# Altium schematic sheet PD_MK2_Main.SchDoc: Sample Sheet Title
size B; Date: MM/DD/YYYY; Author: Sample Author; Organization: ORGANIZATION; Address1: ADDRESS 1; Address2: ADDRESS 2; Address3: ADDRESS 3; Address4: ADDRESS 4; Revision: -; SheetNumber: 2; SheetTotal: 2; ENG_APP_DATE: --/--/--; DSN_APP_DATE: --/--/--; CHK_APP_DATE: --/--/--
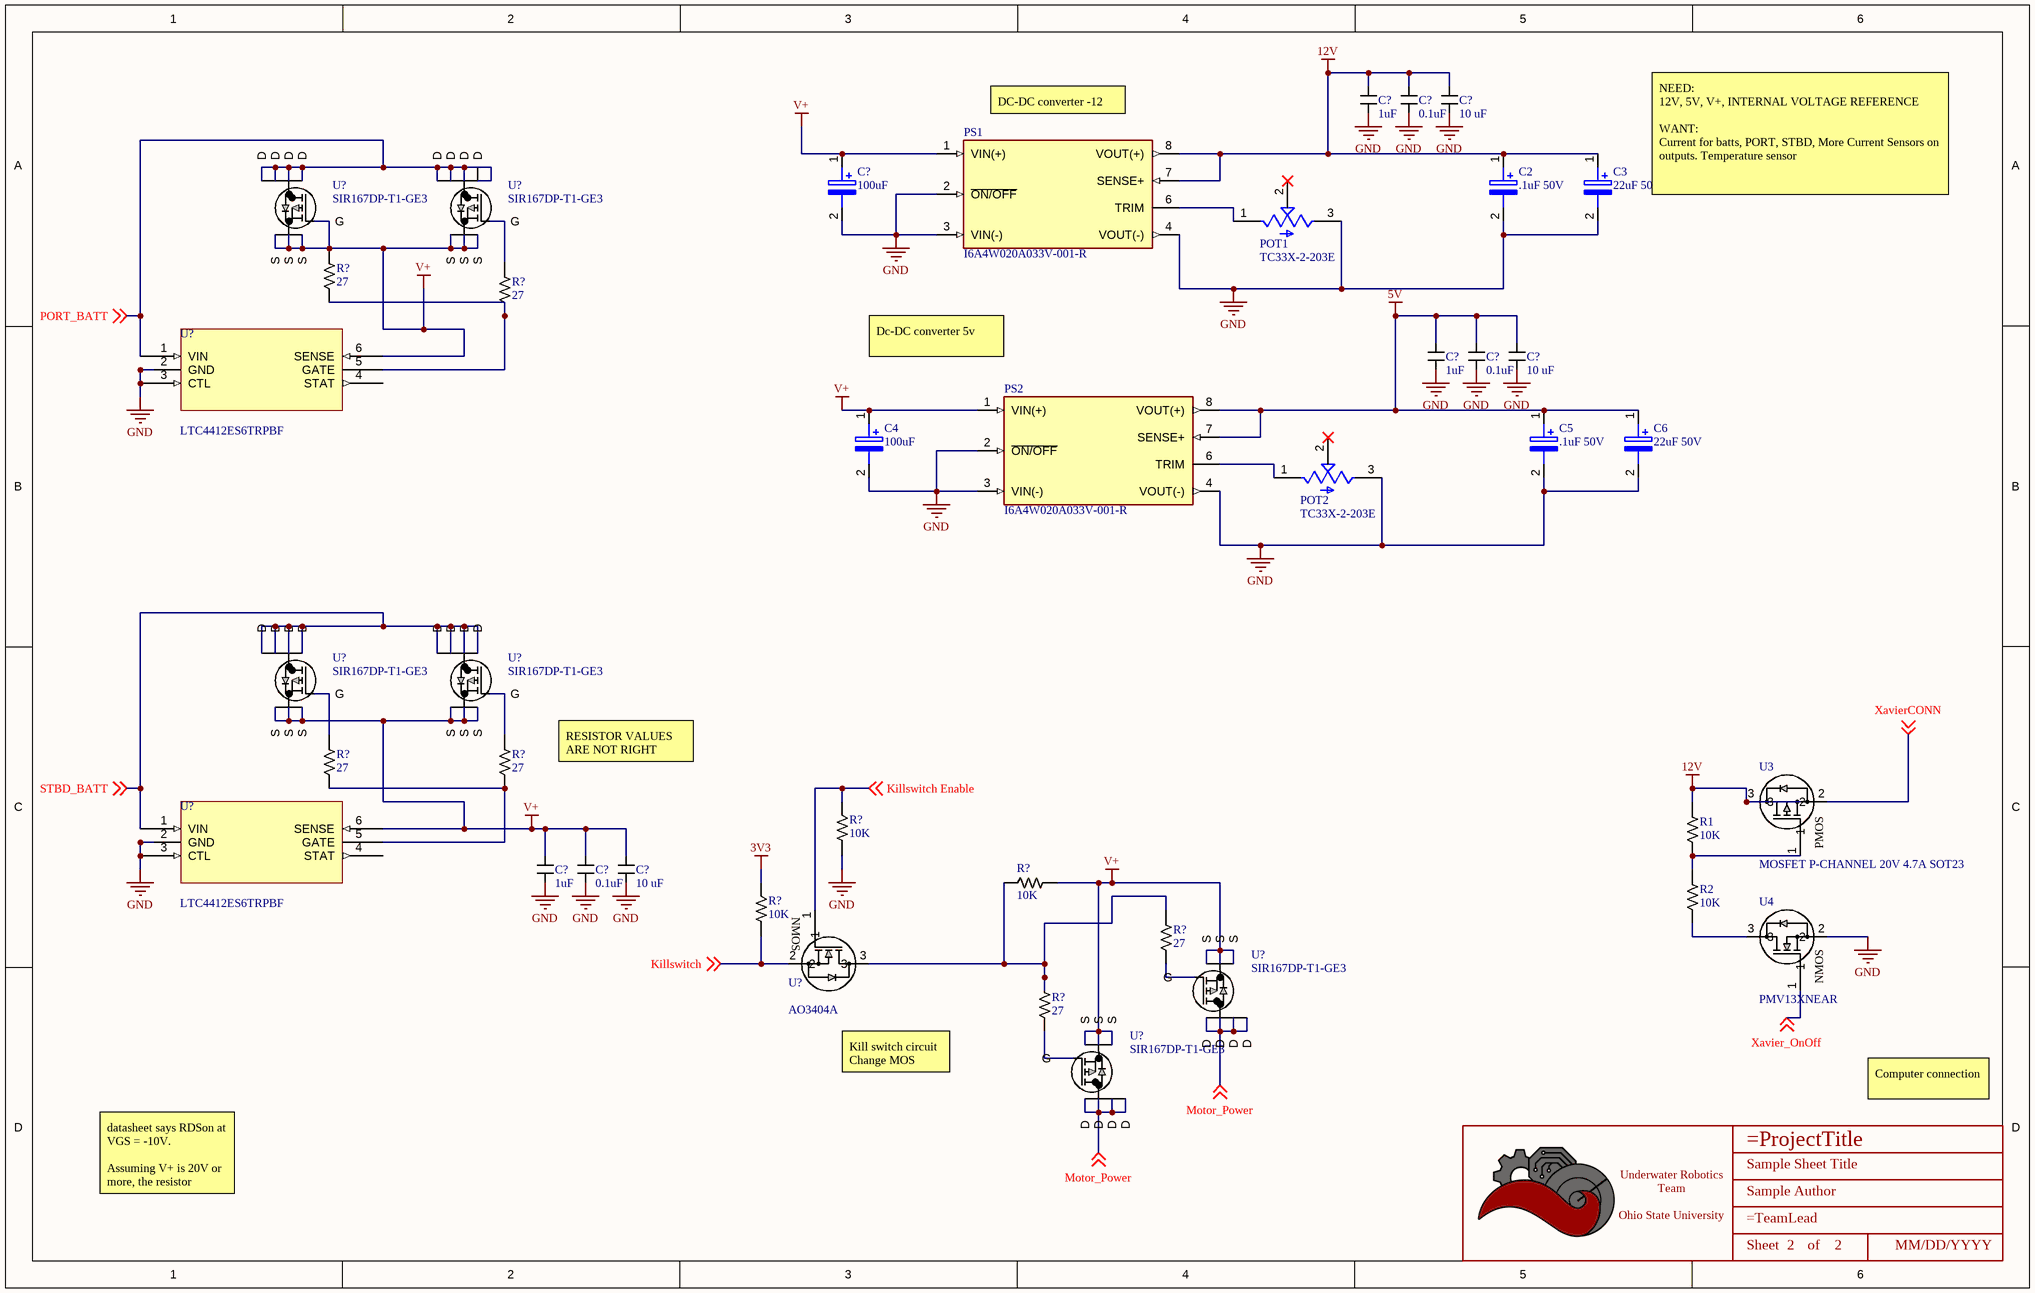
[diagram p0: PD_MK2_Main.SchDoc]

## Parts
(Parts that share a designator on the sheet are numbered #1, #2 ... from top to bottom, then left to right.)
*  Title_Block  [LOGO]  (value not drawn)  (graphical)
C2  .1uF 50V  [CAPAE430X550N]
C3  22uF 50V  [CAPAE430X550N]
C4  100uF  [CAPAE430X550N]
C5  .1uF 50V  [CAPAE430X550N]
C6  22uF 50V  [CAPAE430X550N]
C?#1  value 1uF  [CAPACITOR_0603]  (hidden comment: 1uF Ceramic 16V)
C?#2  value 0.1uF  [CAPACITOR_0603]  (hidden comment: 100nF Ceramic 6.3V)
C?#3  Value (uF): 10 uF  [CAPACITOR_0603]  (hidden comment: 10uF Ceramic 6.3V)
C?#4  100uF  [CAPAE430X550N]
C?#5  value 1uF  [CAPACITOR_0603]  (hidden comment: 1uF Ceramic 16V)
C?#6  value 0.1uF  [CAPACITOR_0603]  (hidden comment: 100nF Ceramic 6.3V)
C?#7  Value (uF): 10 uF  [CAPACITOR_0603]  (hidden comment: 10uF Ceramic 6.3V)
C?#8  value 1uF  [CAPACITOR_0603]  (hidden comment: 1uF Ceramic 16V)
C?#9  value 0.1uF  [CAPACITOR_0603]  (hidden comment: 100nF Ceramic 6.3V)
C?#10  Value (uF): 10 uF  [CAPACITOR_0603]  (hidden comment: 10uF Ceramic 6.3V)
POT1  TC33X-2-203E  [TRIM_TC33X-2-203E]
POT2  TC33X-2-203E  [TRIM_TC33X-2-203E]
PS1  I6A4W020A033V-001-R  [CONV_I6A4W020A033V-001-R]
PS2  I6A4W020A033V-001-R  [CONV_I6A4W020A033V-001-R]
R1  Value  (Ohms): 10K  [RESISTOR_0603]  (hidden comment: 10k Ohm 5% 1/10W)
R2  Value  (Ohms): 10K  [RESISTOR_0603]  (hidden comment: 10k Ohm 5% 1/10W)
R?#1  Value  (Ohms): 27  [RESISTOR_0603]  (hidden comment: 27 Ohm 5% 1/8W)
R?#2  Value  (Ohms): 27  [RESISTOR_0603]  (hidden comment: 27 Ohm 5% 1/8W)
R?#3  Value  (Ohms): 27  [RESISTOR_0603]  (hidden comment: 27 Ohm 5% 1/8W)
R?#4  Value  (Ohms): 27  [RESISTOR_0603]  (hidden comment: 27 Ohm 5% 1/8W)
R?#5  Value  (Ohms): 10K  [RESISTOR_0603]  (hidden comment: 10k Ohm 5% 1/10W)
R?#6  Value  (Ohms): 10K  [RESISTOR_0603]  (hidden comment: 10k Ohm 5% 1/10W)
R?#7  Value  (Ohms): 10K  [RESISTOR_0603]  (hidden comment: 10k Ohm 5% 1/10W)
R?#8  Value  (Ohms): 27  [RESISTOR_0603]  (hidden comment: 27 Ohm 5% 1/8W)
R?#9  Value  (Ohms): 27  [RESISTOR_0603]  (hidden comment: 27 Ohm 5% 1/8W)
U3  MOSFET P-CHANNEL 20V 4.7A SOT23  [SOT-23-3]
U4  PMV13XNEAR  [SOT-23-3]
U?#1  SIR167DP-T1-GE3  [MOSFET_7DP-T1-GE3_VIS]
U?#2  SIR167DP-T1-GE3  [MOSFET_7DP-T1-GE3_VIS]
U?#3  LTC4412ES6TRPBF  [TSOT-23_S6]
U?#4  SIR167DP-T1-GE3  [MOSFET_7DP-T1-GE3_VIS]
U?#5  SIR167DP-T1-GE3  [MOSFET_7DP-T1-GE3_VIS]
U?#6  LTC4412ES6TRPBF  [TSOT-23_S6]
U?#7  AO3404A  [SOT-23-3]
U?#8  SIR167DP-T1-GE3  [MOSFET_7DP-T1-GE3_VIS]
U?#9  SIR167DP-T1-GE3  [MOSFET_7DP-T1-GE3_VIS]

## Nets
3V3: R?#7.2
5V: C5.1(POS) C6.1(POS) C?#5.1 C?#6.1 C?#7.1 PS2.7(SENSE+) PS2.8(VOUT(+))
12V: C2.1(POS) C3.1(POS) C?#1.1 C?#2.1 C?#3.1 PS1.7(SENSE+) PS1.8(VOUT(+)) R1.1 U3.3
GND: C2.2(NEG) C3.2(NEG) C4.2(NEG) C5.2(NEG) C6.2(NEG) C?#1.2 C?#2.2 C?#3.2 C?#4.2(NEG) C?#5.2 C?#6.2 C?#7.2 C?#8.2 C?#9.2 C?#10.2 POT1.3(CW) POT2.3(CW) PS1.2(~{ON/OFF}) PS1.3(VIN(-)) PS1.4(VOUT(-)) PS2.2(~{ON/OFF}) PS2.3(VIN(-)) PS2.4(VOUT(-)) R?#5.1 U4.2 U?#3.2(GND) U?#3.3(CTL) U?#6.2(GND) U?#6.3(CTL)
V+: C4.1(POS) C?#4.1(POS) C?#8.1 C?#9.1 C?#10.1 PS1.1(VIN(+)) PS2.1(VIN(+)) R?#1.1 R?#6.1 U?#1.1(S) U?#1.2(S) U?#1.3(S) U?#1.4(G) U?#2.1(S) U?#2.2(S) U?#2.3(S) U?#3.6(SENSE) U?#4.1(S) U?#4.2(S) U?#4.3(S) U?#5.1(S) U?#5.2(S) U?#5.3(S) U?#6.6(SENSE) U?#8.1(S) U?#8.2(S) U?#8.3(S) U?#9.1(S) U?#9.2(S) U?#9.3(S)
Killswitch: R?#7.1 U?#7.2 ; off-sheet Killswitch
Killswitch Enable: R?#5.2 U?#7.1 ; off-sheet Killswitch Enable
Motor_Power: U?#8.5(D) U?#8.6(D) U?#8.7(D) U?#8.8(D) U?#9.5(D) U?#9.6(D) U?#9.7(D) U?#9.8(D) ; off-sheet Motor_Power
PORT_BATT: U?#1.5(D) U?#1.6(D) U?#1.7(D) U?#1.8(D) U?#2.5(D) U?#2.6(D) U?#2.7(D) U?#2.8(D) U?#3.1(VIN) ; off-sheet PORT_BATT
STBD_BATT: U?#4.5(D) U?#4.6(D) U?#4.7(D) U?#4.8(D) U?#5.5(D) U?#5.6(D) U?#5.7(D) U?#5.8(D) U?#6.1(VIN) ; off-sheet STBD_BATT
Xavier_OnOff: U4.1 ; off-sheet Xavier_OnOff
XavierCONN: U3.2 ; off-sheet XavierCONN
NetPOT1_1: POT1.1(CCW) PS1.6(TRIM)
NetPOT2_1: POT2.1(CCW) PS2.6(TRIM)
NetR1_2: R1.2 R2.1 U3.1
NetR2_2: R2.2 U4.3
NetR?#1_2: R?#1.2 R?#2.2 U?#3.5(GATE)
NetR?#2_1: R?#2.1 U?#2.4(G)
NetR?#3_1: R?#3.1 U?#4.4(G)
NetR?#3_2: R?#3.2 R?#4.2 U?#6.5(GATE)
NetR?#4_1: R?#4.1 U?#5.4(G)
NetR?#6_2: R?#6.2 R?#8.1 R?#9.1 U?#7.3
NetR?#8_2: R?#8.2 U?#8.4(G)
NetR?#9_2: R?#9.2 U?#9.4(G)

Not connected (* = marked no-connect by the designer): POT1 2(W)*; POT2 2(W)*; U?#3 4(STAT); U?#6 4(STAT)

## Notes on the sheet
- (near PS1) DC-DC converter -12
- NEED:
  12V, 5V, V+, INTERNAL VOLTAGE REFERENCE
  WANT:
  Current for batts, PORT, STBD, More Current Sensors on outputs. Temperature sensor
- Dc-DC converter 5v
- RESISTOR VALUES ARE NOT RIGHT (R27-R30)
- Kill switch circuit Change MOS
- Computer connection
- datasheet says RDSon at VGS = -10V.
  Assuming V+ is 20V or more, the resistor divider will make Vg 10 V which would mean VGS is -10V
- DWG. NO.
- REV.
- SHT.
- THIS DOCUMENT AND THE DATA DISCLOSED HEREIN OR HEREWITH IS THE PROPERTY OF ALTIUM LIMITED AND MAY BE FREELY DISTRIBUTED IN WHOLE. NO RIGHTS ARE RESERVED OR EXPRESS OR IMPLIED WARANTEE GIVEN.
- REVISION
- DESCRIPTION
- DATE
- APPROVED
- ENG:
- APPROVALS
- PROJECT
- DSN:
- CHK:
- REFERENCE DOCUMENTS
- PROJECT REVISION:
- TITLE
- DOCUMENT REVISION:
- DESIGN ITEM:
- BOM:
- FAB DWG:
- PCB DWG:
- ASSY DWG:
- SCALE:
- SIZE
- B
- CAGE CODE
- FILE NAME
- DWG NO.
- SHEET
- OF
- REV
- (in symbol AO3404A) NMOS
- (in symbol PMV13XNEAR) NMOS
- (in symbol Title_Block) Underwater Robotics Team / Ohio State University; Sheet; of
- (in symbol TSM500P02CX) PMOS

## Library data of the parts
* = Title_Block: UWRT Schematic Title Block Template / Created June 2021, Dylan Trainor
C2-C6 C?#4 = 865250340002: 4.7ÂµF 16V Aluminum Electrolytic Capacitors Radial, Can - SMD 2000 Hrs @ 85Â°C; MF: Wurth Elektronik; Value: *; SnapEDA_Link: https://www.snapeda.com/parts/865250340002/W%C3%BCrth%20Elektronik/view-part/5002976/?ref=snap; MP: 865250340002; Purchase-URL: https://pricing.snapeda.com/search/part/865250340002/?ref=eda; Check_prices: https://www.snapeda.com/parts/865250340002/W%C3%BCrth%20Elektronik/view-part/5002976/?ref=eda; Availability: Warning; Price: None; Package: None
C?#1 C?#5 C?#8 = CAPACITOR_1uF_0603: Cap 1uF 16V +/-10% / Ceramic 0603; Made By: Flip B; Tolerance: +/- 10%; Voltage: 16V; Supplier 1: Digi-Key; Supplier Part Number 1: 399-7847-1-ND
C?#2 C?#6 C?#9 = CAPACITOR_0.1uF_0603: Cap 100nF 6.3V +/-10% / Ceramic 0603; Made By: Flip B; ComponentLink1Description: Datsheet; ComponentLink1URL: https://www.mouser.com/datasheet/2/212/KEM_C1002_X7R_SMD-1102033.pdf; Tolerance: +/- 10%; Voltage: 6.3V; Supplier 1: Digi-Key; Supplier Part Number 1: 399-15351-1-ND
C?#3 C?#7 C?#10 = CAPACITOR_10uF_0603: Cap 10uF 6.3V +/-20% / Ceramic 0603; Made By: Flip B; ComponentLink1Description: Digikey; ComponentLink1URL: https://www.digikey.com/en/products/detail/samsung-electro-mechanics/CL10A106MQ8NNNC/3886777; Supplier 1: Digi-Key; Supplier Part Number 1: 1276-1119-1-ND; Tolerance: +/- 20%; Voltage: 6.3V
POT1 POT2 = TC33X-2-203E: 20 kOhms 0.1W, 1/10W J Lead Surface Mount Trimmer Potentiometer Cermet 1 Turn Top Adjustment; MF: Bourns; Value: *; SnapEDA_Link: https://www.snapeda.com/parts/TC33X-2-203E/Bourns/view-part/312812/?ref=snap; Check_prices: https://www.snapeda.com/parts/TC33X-2-203E/Bourns/view-part/312812/?ref=eda; Digi-Key_Part_Number: TC33X-2-203ECT-ND; Purchase-URL: https://pricing.snapeda.com/search/part/TC33X-2-203E/?ref=eda; Package: 1608 Bourns; MP: TC33X-2-203E
PS1 PS2 = I6A4W020A033V-001-R: Non-Isolated PoL Module DC DC Converter 1 Output 3.3 ~ 15V 20A 9V - 53V Input; MF: TDK-Lambda Americas; Availability: In Stock; Price: None; Package: DIP-8 TDK-Lambda; MP: I6A4W020A033V-001-R; Value: *; SnapEDA_Link: https://www.snapeda.com/parts/I6A4W020A033V-001-R/TDK-Lambda%20Americas%20Inc./view-part/1737324/?ref=snap; Check_prices: https://www.snapeda.com/parts/I6A4W020A033V-001-R/TDK-Lambda%20Americas%20Inc./view-part/1737324/?ref=eda; Purchase-URL: https://pricing.snapeda.com/search/part/I6A4W020A033V-001-R/?ref=eda
R1 R2 R?#5-R?#7 = RESISTOR_10K_0603: RES 10k OHM 5% 1/10W 0603; Tolerance: +/- 5%; Wattage: 1/8W; Made By: Robert Pafford; ComponentLink1Description: Datasheet; ComponentLink1URL: https://www.bourns.com/docs/product-datasheets/CRxxxxx.pdf; Supplier: Digikey; Digikey Part Numer: CR0603-JW-104ELFTR-ND; Supplier 1: Digi-Key; Supplier Part Number 1: 2019-RK73B1JTTD103JCT-ND
R?#1-R?#4 R?#8 R?#9 = RESISTOR_27_0603: RES 27 OHM 5% 1/8W 0603; Tolerance: +/- 5%; Made By: Robert Pafford; ComponentLink1Description: Datasheet; ComponentLink1URL: https://www.bourns.com/docs/product-datasheets/CRxxxxx.pdf; Wattage: 1/8W; Supplier: Digikey; Digikey Part Numer: CR0603-JW-104ELFTR-ND; Supplier 1: Digi-Key; Supplier Part Number 1: 2019-RK73B1JTTD270JCT-ND
U3 = TSM500P02CX: P-Channel 20 V 4.7A (Tc) 1.56W (Tc) Surface Mount SOT-23; Vendor: Taiwan Semiconductor Corporation; Vgs (Max): ±10V; Vgs (th): 800mV @ 250µA; Rds (on): 50mOhm @ 3A, 4.5V; Amp Rating: 4.7 A; FET Type: P-Channel; Package: TO-236-3, SC-59, SOT-23-3; Manufacturer_Part_Number: TSM500P02CX; Vdss: 20 V; Power Dissipation: 1.56W (Tc); Created By: Robert Pafford; Supplier 1: Digi-Key; Supplier Part Number 1: TSM500P02CXRFGCT-ND
U4 = PMV13XNEAR: N-Channel 20 V 7.3A (Ta) 610mW (Ta), 8.3W (Tc) Surface Mount TO-236AB; Vendor: Nexperia USA Inc.; SourceLibrary: ON_Semiconductor_2020-01-13; Vgs (Max): +/- 12 V; Vgs (th): 1.3V @ 250uA; Vdss: 20 V; Rds (on): 15mOhm @ 7.3A, 8V; Amp Rating: 7.3 A; FET Type: N-Channel; Package: SOT23-3L; Manufacturer _Part_Number: PMV13XNEAR; Power Dissipation: 610mW (Ta), 8.3W (Tc); Created By: Dylan T; Supplier 1: Mouser; Supplier Part Number 1: 771-PMV13XNEAR
U?#1 U?#2 U?#4 U?#5 U?#8 U?#9 = SIR167DP-T1-GE3: P-Channel 30 V 60A (Tc) 65.8W (Tc) Surface Mount PowerPAK® SO-8; Mfr_Name: Vishay; Copyright: Copyright (C) 2022 Ultra Librarian. All rights reserved.; Manufacturer_Part_Number: SIR167DP-T1-GE3; RefDes: RefDes; Type: DEV
U?#3 U?#6 = LTC4412ES6TRPBF: OR Controller Source Selector Switch P-Channel 2:1 TSOT-23-6; MP: LTC4412ES6#TRPBF; MF: Analog Devices; Price: None; Availability: Good; Mouser-Purchase-URL: https://snapeda.com/shop?store=Mouser&id=4343773; Arrow_Europe-Purchase-URL: https://snapeda.com/shop?store=Arrow+Europe&id=4343773; DigiKey-Purchase-URL: https://snapeda.com/shop?store=DigiKey&id=4343773; Package: SOT-23-6 Analog Devices; SnapEDA_Link: https://www.snapeda.com/parts/LTC4412ES6%23TRPBF/Analog%20Devices/view-part/4343773/?ref=snap; Value: *; Check_prices: https://www.snapeda.com/parts/LTC4412ES6%23TRPBF/Analog%20Devices/view-part/4343773/?ref=eda
U?#7 = AO3404A: N-Channel 30 V 5.8A (Ta) 1.4W (Ta) Surface Mount SOT-23-3; Vendor: Alpha & Omega Semiconductor Inc.; SourceLibrary: ON_Semiconductor_2020-01-13; Vgs (Max): 3V @ 5.8A, 10V; Vgs (th): 3V @ 250µA; Vdss: 30V; Rds (on): 28mOhm @ 5.8A, 10V; Amp Rating: 5.8 A; FET Type: N-Channel; Package: SOT23-3L; Manufacturer _Part_Number: AO3404A; Power Dissipation: 1.4W (Ta); Supplier 1: Digi-Key; Supplier Part Number 1: 785-1004-1-ND; Created By: Dylan T